# EAGLE design WWVB_BINARY_CLOCK (EAGLE 5.11)
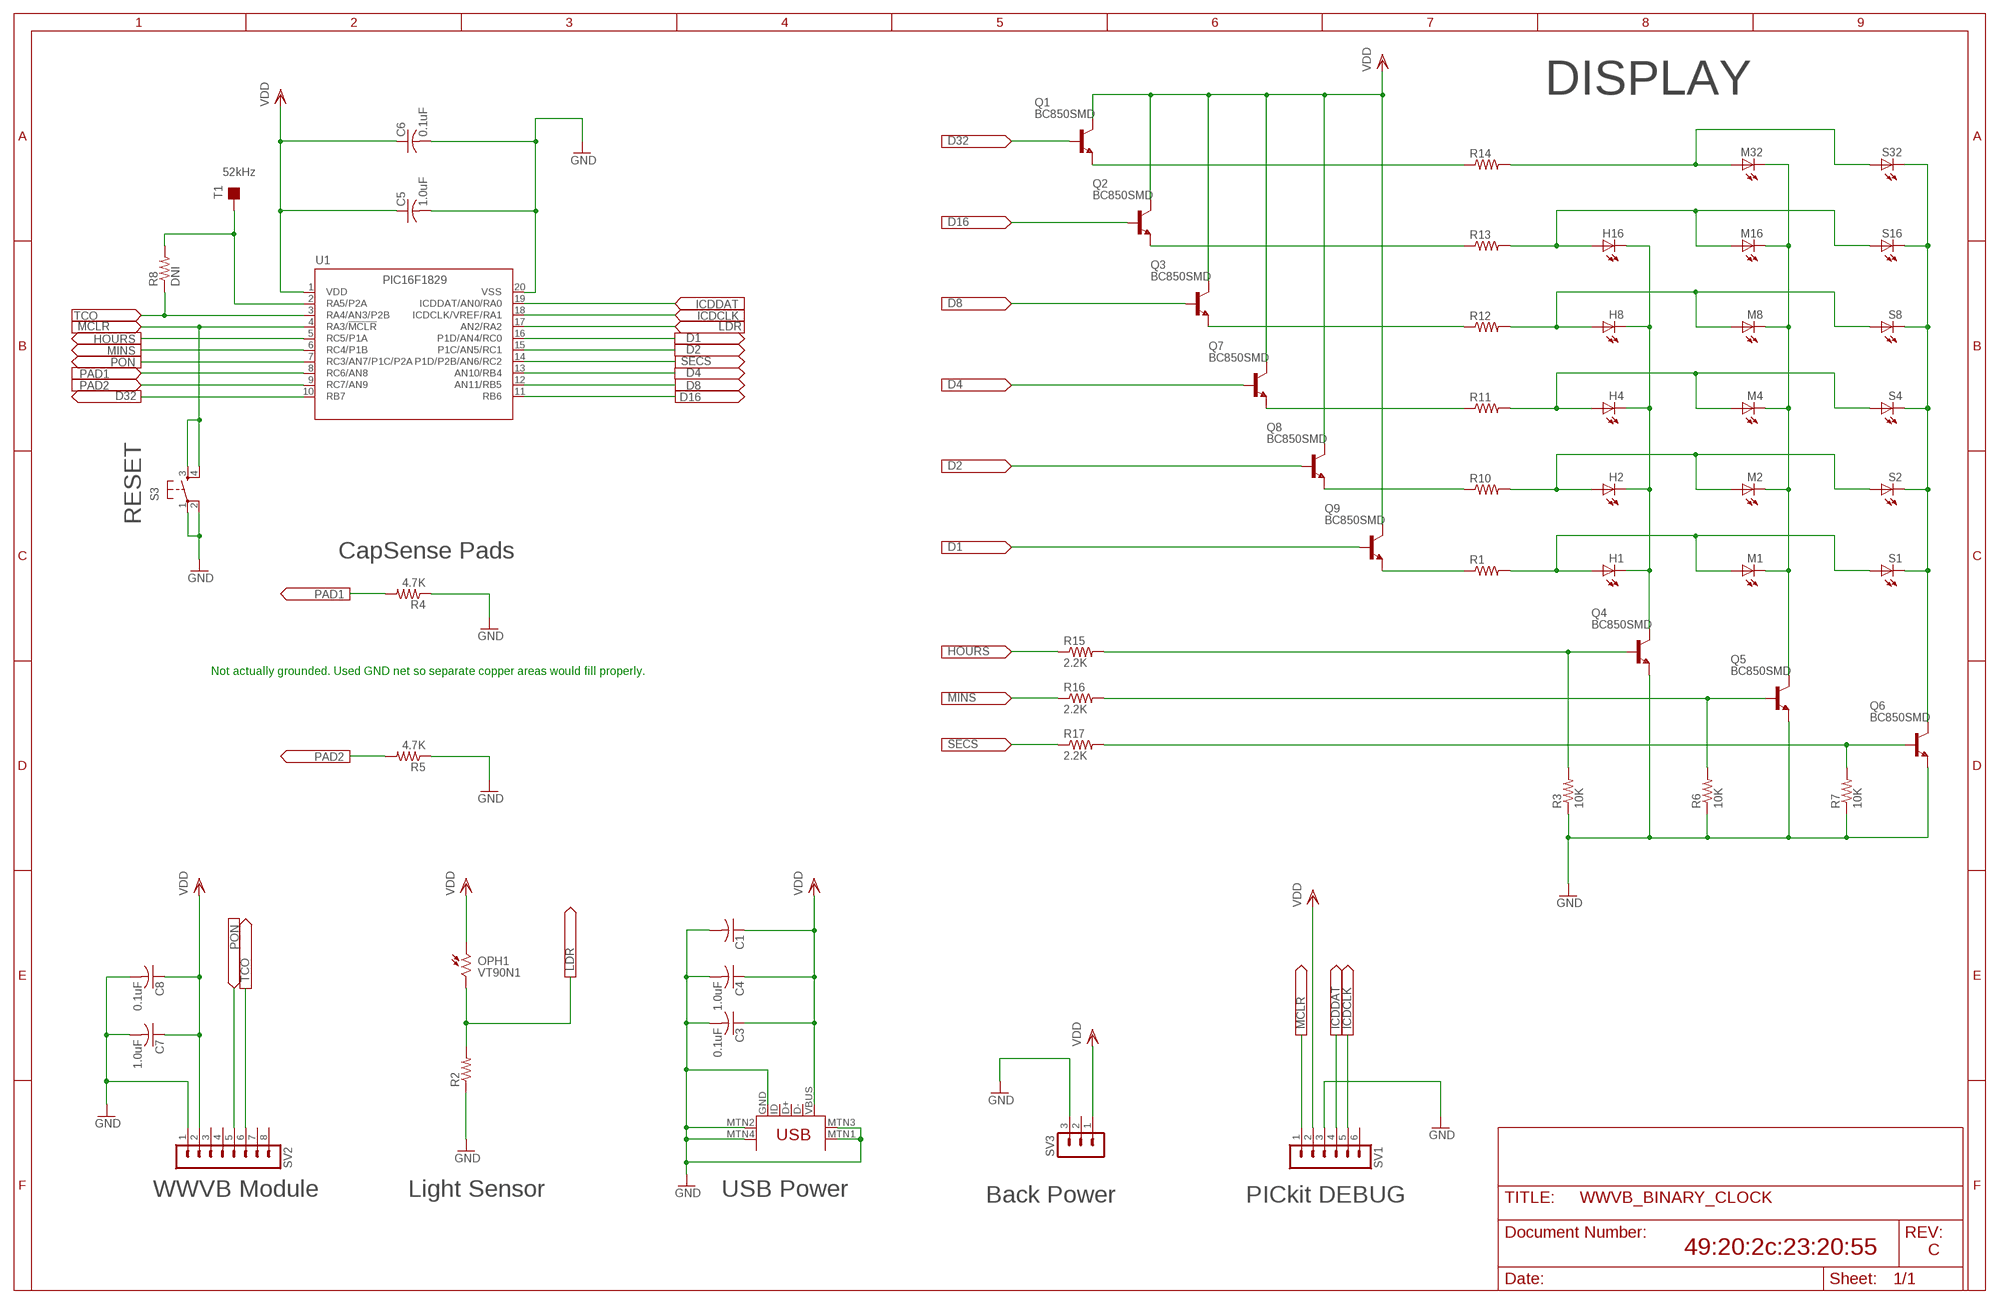
[diagram p0: schematic, sheet 1]

## Parts
C1  C-USC1206  [C1206]
C3  0.1uF  C-USC0805  [C0805]
C4  1.0uF  C-USC0805  [C0805]
C5  1.0uF  C-USC0805  [C0805]
C6  0.1uF  C-USC0805  [C0805]
C7  1.0uF  C-USC0805  [C0805]
C8  0.1uF  C-USC0805  [C0805]
H1  LED5MM  [LED5MM]
H2  LED5MM  [LED5MM]
H4  LED5MM  [LED5MM]
H8  LED5MM  [LED5MM]
H16  LED5MM  [LED5MM]
M1  LED5MM  [LED5MM]
M2  LED5MM  [LED5MM]
M4  LED5MM  [LED5MM]
M8  LED5MM  [LED5MM]
M16  LED5MM  [LED5MM]
M32  LED5MM  [LED5MM]
OPH1  VT90N1  [VT900]
Q1  BC850SMD  [SOT23-BEC]
Q2  BC850SMD  [SOT23-BEC]
Q3  BC850SMD  [SOT23-BEC]
Q4  BC850SMD  [SOT23-BEC]
Q5  BC850SMD  [SOT23-BEC]
Q6  BC850SMD  [SOT23-BEC]
Q7  BC850SMD  [SOT23-BEC]
Q8  BC850SMD  [SOT23-BEC]
Q9  BC850SMD  [SOT23-BEC]
R1  R-US_R0805  [R0805]
R2  R-US_M0805  [M0805]
R3  10K  R-US_M0805  [M0805]
R4  4.7K  R-US_R0805  [R0805]
R5  4.7K  R-US_M0805  [M0805]
R6  10K  R-US_M0805  [M0805]
R7  10K  R-US_R0805  [R0805]
R8  DNI  R-US_R0805  [R0805]
R10  R-US_M0805  [M0805]
R11  R-US_M0805  [M0805]
R12  R-US_M0805  [M0805]
R13  R-US_M0805  [M0805]
R14  R-US_M0805  [M0805]
R15  2.2K  R-US_M0805  [M0805]
R16  2.2K  R-US_M0805  [M0805]
R17  2.2K  R-US_R0805  [R0805]
S1  LED5MM  [LED5MM]
S2  LED5MM  [LED5MM]
S3  TAC_SWITCHPTH  [TACTILE-PTH]
S4  LED5MM  [LED5MM]
S8  LED5MM  [LED5MM]
S16  LED5MM  [LED5MM]
S32  LED5MM  [LED5MM]
SV1  MA06-1  [MA06-1]
SV2  MA08-1  [MA08-1]
SV3  MA03-1  [MA03-1]
T1  TESTPOINTKEYSTONE5015  [KEYSTONE5015]
U1  PIC16F1829  [SOIC20S]
X1  USB-MINIB-5PIN  [USB-MINIB]

## Nets
AN2: OPH1.2 R2.2 U1.17(AN2/RA2)
CPS8: R4.2 U1.8(RC6/AN8)
CPS9: R5.2 U1.9(RC7/AN9)
GND: C1.2 C3.2 C4.2 C5.2 C6.2 C7.2 C8.2 Q4.E Q5.E Q6.E R2.1 R3.1 R4.1 R5.1 R6.1 R7.1 S3.1 S3.2 SV1.3 SV2.1 SV3.3 U1.20(VSS) X1.GND X1.MTN1(MTN2) X1.MTN2(MTN3) X1.MTN3(MTN1) X1.MTN4
ICDCLK: SV1.5 U1.18(ICDCLK/VREF/RA1)
ICDDAT: SV1.4 U1.19(ICDDAT/AN0/RA0)
M1: M1.K(C) M2.K(C) M4.K(C) M8.K(C) M16.K(C) M32.K(C) Q5.C
MCLR: S3.3 S3.4 SV1.1 U1.4(RA3/!MCLR)
N$1: Q9.E R1.1
N$2: Q8.E R10.1
N$3: Q7.E R11.1
N$4: Q3.E R12.1
N$5: Q2.E R13.1
N$6: Q1.E R14.1
N$7: R8.2 T1.1 U1.2(RA5/P2A)
N$10: H1.K(C) H2.K(C) H4.K(C) H8.K(C) H16.K(C) Q4.C
N$11: H1.A M1.A R1.2 S1.A
N$12: H2.A M2.A R10.2 S2.A
N$16: H4.A M4.A R11.2 S4.A
N$17: H8.A M8.A R12.2 S8.A
N$18: H16.A M16.A R13.2 S16.A
N$19: M32.A R14.2 S32.A
N$20: Q4.B R3.2 R15.2
N$21: Q5.B R6.2 R16.2
N$22: Q6.B R7.2 R17.2
P1A: R15.1 U1.5(RC5/P1A)
P1B: R16.1 U1.6(RC4/P1B)
P1D: R17.1 U1.14(P1D/P2B/AN6/RC2)
RB4: Q7.B U1.13(AN10/RB4)
RB5: Q3.B U1.12(AN11/RB5)
RB6: Q2.B U1.11(RB6)
RB7: Q1.B U1.10(RB7)
RC0: Q9.B U1.16(P1D/AN4/RC0)
RC1: Q8.B U1.15(P1C/AN5/RC1)
RC3: SV2.5 U1.7(RC3/AN7/P1C/P2A)
S4: Q6.C S1.K(C) S2.K(C) S4.K(C) S8.K(C) S16.K(C) S32.K(C)
T1G: R8.1 SV2.6 U1.3(RA4/AN3/P2B)
VDD: C1.1 C3.1 C4.1 C5.1 C6.1 C7.1 C8.1 OPH1.1 Q1.C Q2.C Q3.C Q7.C Q8.C Q9.C SV1.2 SV2.2 SV3.1 U1.1(VDD) X1.VBUS
Unconnected: SV1.6 SV2.3 SV2.4 SV2.7 SV2.8 SV3.2 X1.D+ X1.D- X1.ID

## Notes on the sheet
- DISPLAY
- 52kHz
- RESET
- CapSense Pads
- Not actually grounded. Used GND net so separate copper areas would fill properly.
- Back Power | PICkit DEBUG
- WWVB Module | Light Sensor | USB Power
- 49:20:2c:23:20:55 | C

## Library data of the parts
C1 C3-C8 = resistor:C-US: CAPACITOR, American symbol
H1 H2 H4 H8 H16 M1 M2 M4 M8 M16 M32 S1 S2 S4 S8 S16 S32 = led:LED: LED OSRAM: - CHIPLED LG R971, LG N971, LY N971, LG Q971, LY Q971, LO R971, LY R971 LH N974, LH R974 LS Q976, LO Q976, LY Q976 LO Q996 - Hyper CHIPLED LW Q18S LB Q993, LB Q99A, LB R99A - SideLED LS A670, LO A670, LY A670, LG A670, LP A670 LB A673, LV A673, LT A673, LW A673 LH A674 LY A675 LS A676, LA A676, LO A676, LY A676, LW A676 LS A679, LY A679, LG A679 - Hyper Micro SIDELED® LS Y876, LA Y876, LO Y876, LY Y876 LT Y87S - SmartLED LW L88C, LW L88S LB L89C, LB L89S, LG L890 LS L89K, LO L89K, LY L89K LS L896, LA L896, LO L896, LY L896 - TOPLED LS T670, LO T670, LY T670, LG T670, LP T670 LSG T670, LSP T670, LSY T670, LOP T670, LYG T670 LG T671, LOG T671, LSG T671 LB T673, LV T673, LT T673, LW T673 LH T674 LS T676, LA T676, LO T676, LY T676, LB T676, LH T676, LSB T676, LW T676 LB T67C, LV T67C, LT T67C, LS T67K, LO T67K, LY T67K, LW E67C LS E67B, LA E67B, LO E67B, LY E67B, LB E67C, LV E67C, LT E67C LW T67C LS T679, LY T679, LG T679 LS T770, LO T770, LY T770, LG T770, LP T770 LB T773, LV T773, LT T773, LW T773 LH T774 LS E675, LA E675, LY E675, LS T675 LS T776, LA T776, LO T776, LY T776, LB T776 LHGB T686 LT T68C, LB T68C - Hyper Mini TOPLED® LB M676 - Mini TOPLED Santana® LG M470 LS M47K, LO M47K, LY M47K Source: http://www.osram.convergy.de LUXEON: - LUMILED® LXK2-PW12-R00, LXK2-PW12-S00, LXK2-PW14-U00, LXK2-PW14-V00 LXK2-PM12-R00, LXK2-PM12-S00, LXK2-PM14-U00 LXK2-PE12-Q00, LXK2-PE12-R00, LXK2-PE12-S00, LXK2-PE14-T00, LXK2-PE14-U00 LXK2-PB12-K00, LXK2-PB12-L00, LXK2-PB12-M00, LXK2-PB14-N00, LXK2-PB14-P00, LXK2-PB14-Q00 LXK2-PR12-L00, LXK2-PR12-M00, LXK2-PR14-Q00, LXK2-PR14-R00 LXK2-PD12-Q00, LXK2-PD12-R00, LXK2-PD12-S00 LXK2-PH12-R00, LXK2-PH12-S00 LXK2-PL12-P00, LXK2-PL12-Q00, LXK2-PL12-R00 Source: www.luxeon.com KINGBRIGHT: KA-3528ASYC Source: www.kingbright.com
OPH1 = photo-elements:VT9: Photoconductive Cell VT900 Series Source: http://optoelectronics.perkinelmer.com/content/Datasheets/DTS_vt900seriesdatasheet.pdf
Q1-Q9 = transistor-npn:BC850*: NPN Transistor
R1-R8 R10-R17 = resistor:R-US_: RESISTOR, American symbol
S3 = SparkFun:TAC_SWITCH: Momentary Switch Button commonly used for reset or general input. Spark Fun Electronics SKU : COM-00097
SV1 = con-lstb:MA06-1: PIN HEADER; OC_FARNELL: unknown; OC_NEWARK: unknown
SV2 = con-lstb:MA08-1: PIN HEADER; OC_FARNELL: unknown; OC_NEWARK: unknown
SV3 = con-lstb:MA03-1: PIN HEADER; OC_FARNELL: unknown; OC_NEWARK: unknown
T1 = ads4:TESTPOINT: Test point
U1 = atmel:PIC16F1829
X1 = SparkFun:USB-MINIB: Mini-USB "B" connector with 5th pin broken out. Created new symbol breaking out 5th "ID" pin in mini/micro USB connector spec. See: http://en.wikipedia.org/wiki/Mini_usb#Cables. Uses same footprint as 4-pin symbol. Also added pins to connect to mounting / shield pads if required (probably not generally needed as signals aren't shielded once they leave the connector).

## Board
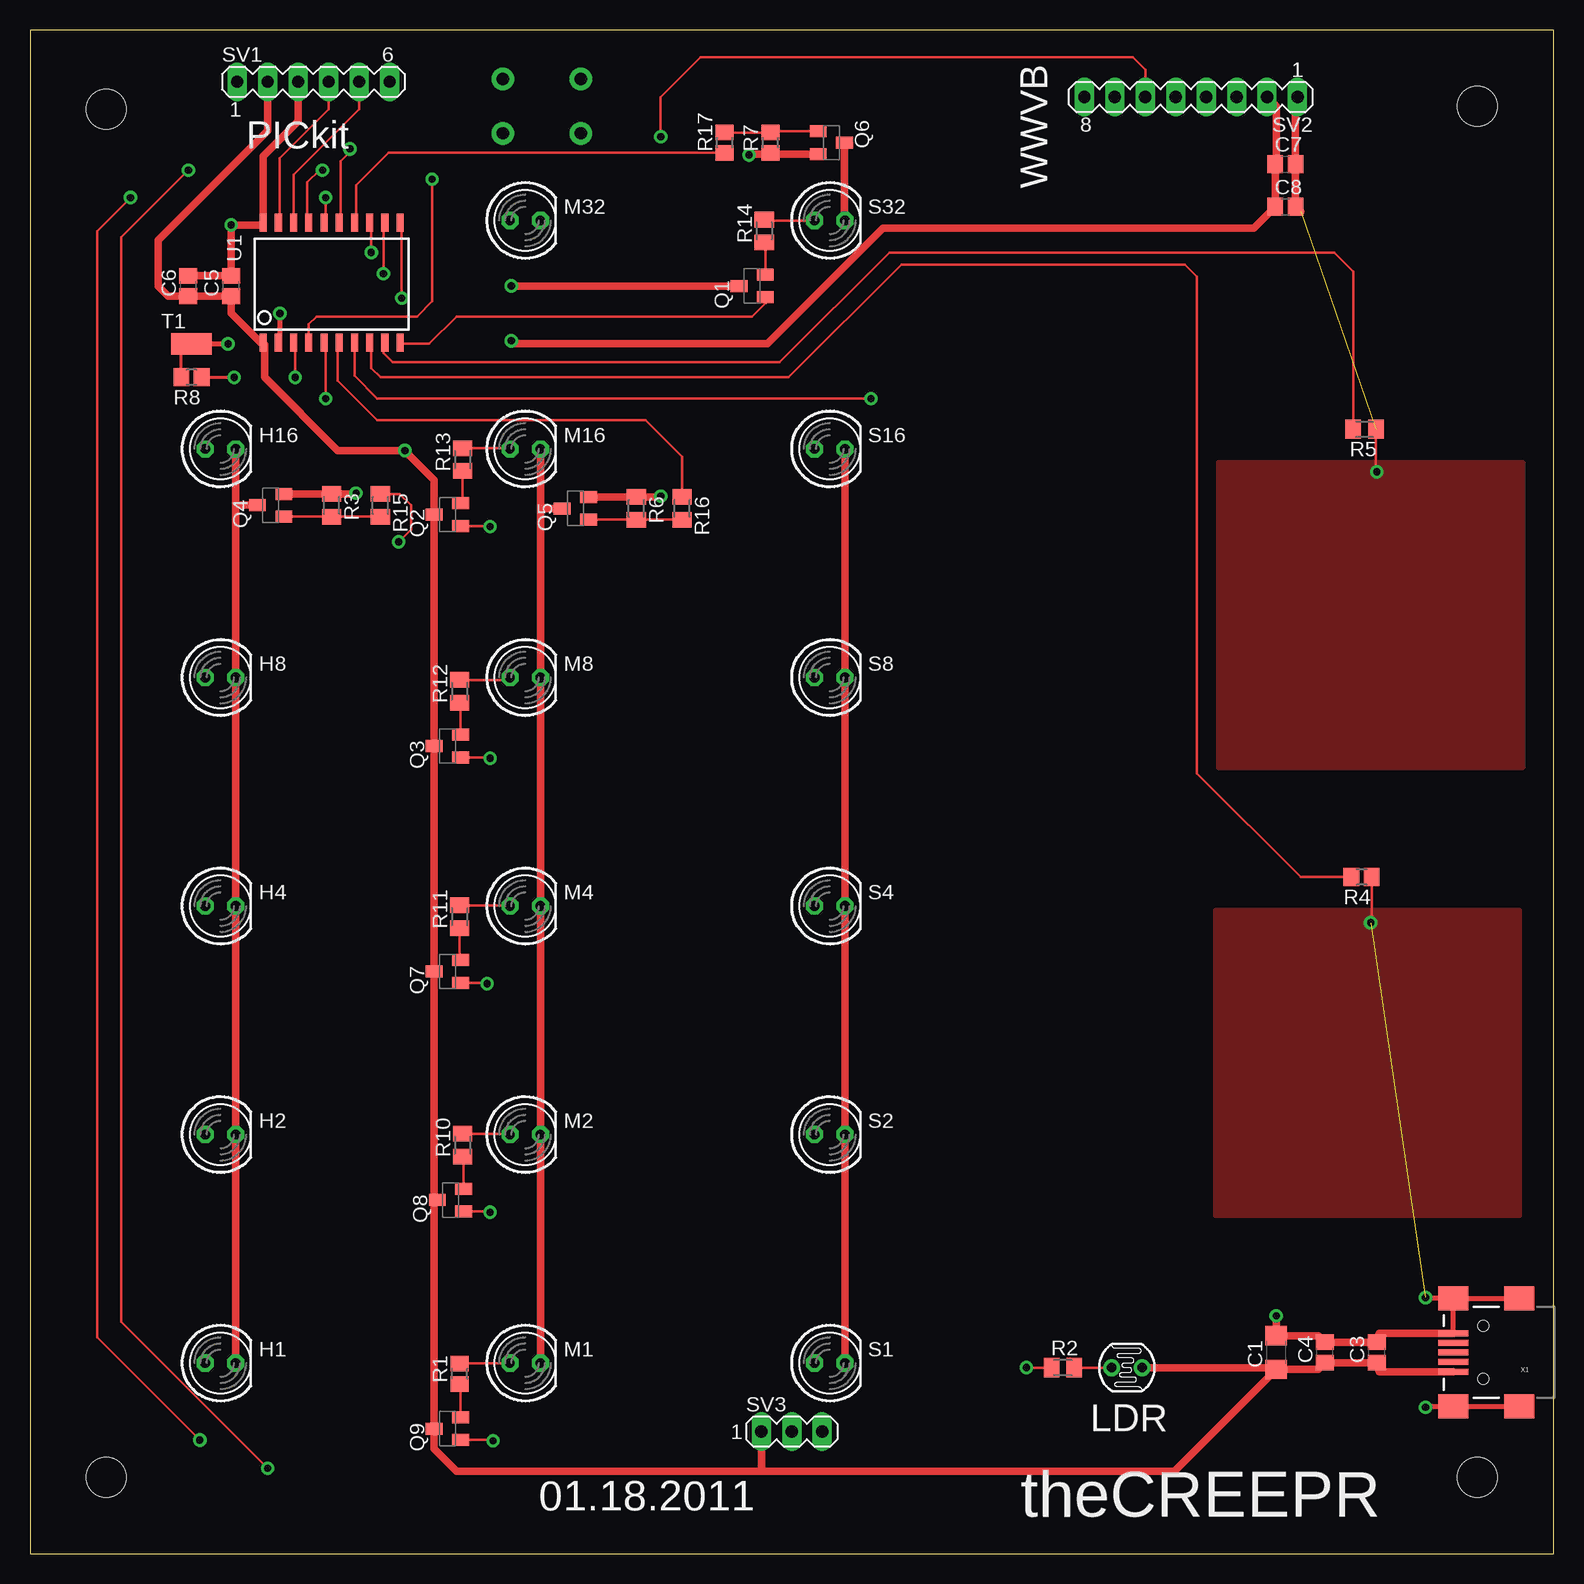
[diagram p1: board, top side]
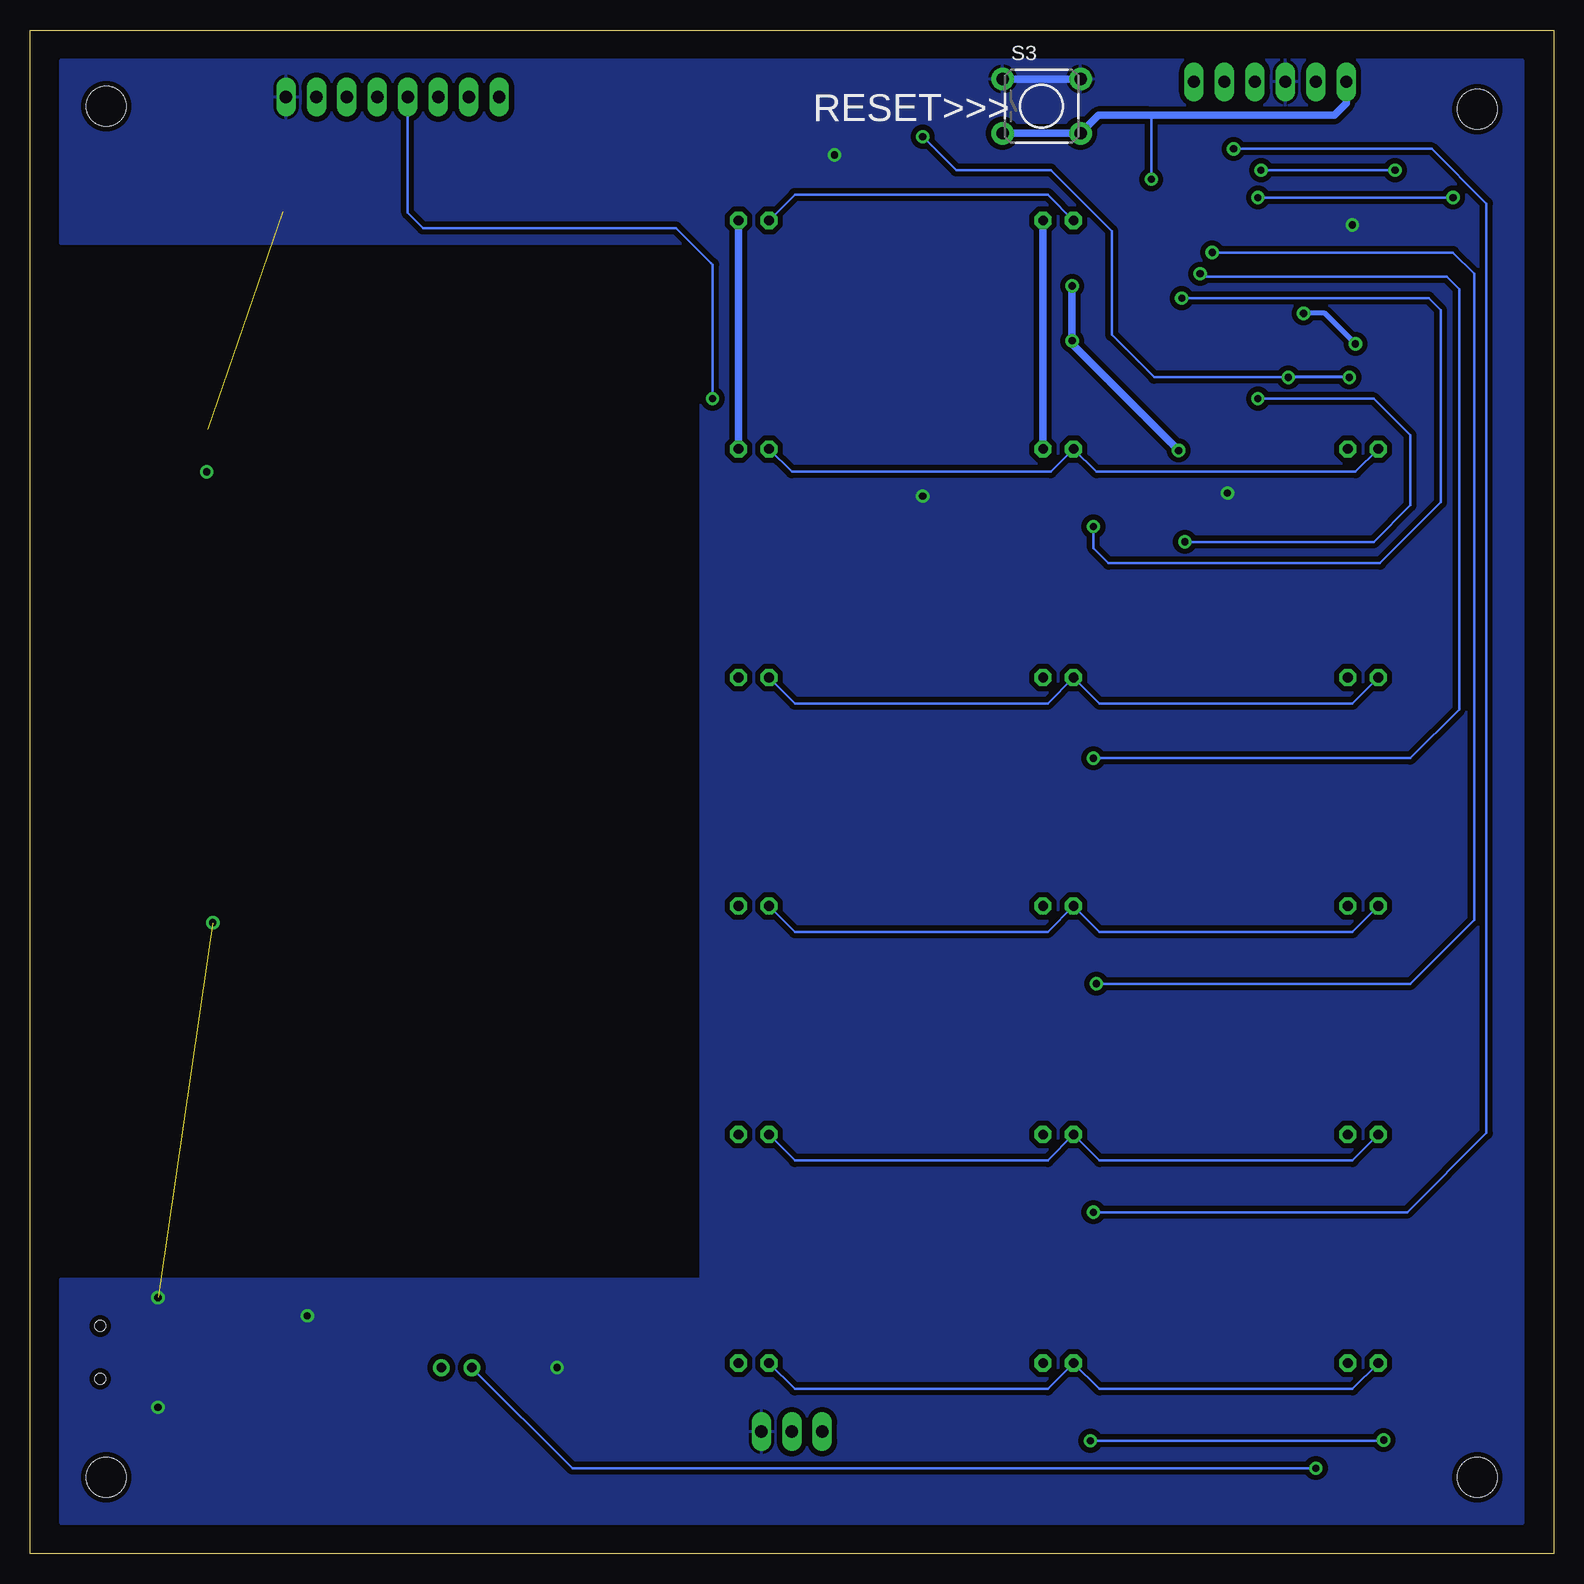
[diagram p2: board, bottom side, seen from below]

Size 127 x 127 mm. Coordinates in mm from the lower left corner, seen from the top.
Outline: 0,0 127,0 127,127 0,127 0,0
Copper layers (1*16): Top 0.035mm / dielectric 1.5mm / Bottom 0.035mm
Design rules "SparkFun": minimum track width 8mil, minimum drill 20mil, track to track 8mil, track to pad 8mil, pad to pad 8mil, via to via 8mil, smd to smd 8mil, copper to edge 10mil, drill to drill 8mil, minimum pad ring 12mil, minimum via ring 10mil, stop-mask expansion 4mil, vias tented up to drill 25mil, thermal gap 10mil
Holes 3.3 mm at 120.65,120.65 120.65,6.35 6.35,6.35 6.35,120.4

### Footprints (pad centres in the part's own frame; a part is rotated, then mirrored left to right if it is on the bottom)
C1206 = smd 1.6 x 1.8: 1 -1.4,0; 2 1.4,0
C0805 = smd 1.3 x 1.5: 1 -0.85,0; 2 0.85,0
LED5MM = drill 0.813 octagon: A -1.27,0; K 1.27,0
VT900 = drill 0.8 pad 1.4 round: 1 -1.27,0; 2 1.27,0
SOT23-BEC = smd 1 x 1.4: B -0.95,-1.1; C 0,1.1; E 0.95,-1.1
R0805 = smd 1.3 x 1.5: 1 -0.85,0; 2 0.85,0
M0805 = smd 1.3 x 1.6: 1 -0.95,0; 2 0.95,0
TACTILE-PTH = drill 1.016 pad 1.88 round: 1 -3.251,2.261; 2 3.251,2.261; 3 -3.251,-2.261; 4 3.251,-2.261
MA06-1 = drill 1.016 long: 1 -6.35,0; 2 -3.81,0; 3 -1.27,0; 4 1.27,0; 5 3.81,0; 6 6.35,0
MA08-1 = drill 1.016 long: 1 -8.89,0; 2 -6.35,0; 3 -3.81,0; 4 -1.27,0; 5 1.27,0; 6 3.81,0; 7 6.35,0; 8 8.89,0
MA03-1 = drill 1.016 long: 1 -2.54,0; 2 0,0; 3 2.54,0
KEYSTONE5015 = smd 3.4 x 1.8: 1 0,0
SOIC20S = smd 0.6 x 1.5: 1 -5.715,-5; 2 -4.445,-5; 3 -3.175,-5; 4 -1.905,-5; 5 -0.635,-5; 6 0.635,-5; 7 1.905,-5; 8 3.175,-5; 9 4.445,-5; 10 5.715,-5; 11 5.715,5; 12 4.445,5; 13 3.175,5; 14 1.905,5; 15 0.635,5; 16 -0.635,5; 17 -1.905,5; 18 -3.175,5; 19 -4.445,5; 20 -5.715,5
USB-MINIB = smd 2.5 x 0.5: D+ 2.5,0; D- 2.5,0.8; GND 2.5,-1.6; ID 2.5,-0.8; VBUS 2.5,1.6 | smd 2.5 x 2: MTN1 -3,4.5; MTN2 2.5,4.5; MTN3 -3,-4.5; MTN4 2.5,-4.5 | hole 0.9: 0,2.2; 0,-2.2

### Placement (x,y rotation side)
C1  103.89,16.76 90 top
C3  112.27,16.76 90 top
C4  107.95,16.76 90 top
C5  16.76,105.66 90 top
C6  13.21,105.66 90 top
C7  104.65,115.82 0 top
C8  104.65,112.27 0 top
H1  15.88,15.88 0 top
H2  15.88,34.92 0 top
H4  15.88,53.98 0 top
H8  15.88,73.03 0 top
H16  15.88,92.08 0 top
M1  41.27,15.88 0 top
M2  41.27,34.92 0 top
M4  41.27,53.98 0 top
M8  41.27,73.03 0 top
M16  41.27,92.08 0 top
M32  41.27,111.12 0 top
OPH1  91.44,15.49 180 top
Q1  60.2,105.66 90 top
Q2  34.8,86.61 90 top
Q3  34.8,67.31 90 top
Q4  20.07,87.38 90 top
Q5  45.47,87.12 90 top
Q6  66.8,117.6 270 top
Q7  34.8,48.51 90 top
Q8  35.05,29.46 90 top
Q9  34.8,10.41 90 top
R1  35.81,14.99 90 top
R2  86.11,15.49 0 top
R3  25.15,87.38 270 top
R4  111,56.39 180 top
R5  111.25,93.73 180 top
R6  50.55,87.12 270 top
R7  61.72,117.6 90 top
R8  13.46,98.04 180 top
R10  36.07,34.04 90 top
R11  35.81,53.09 90 top
R12  35.81,71.88 90 top
R13  36.07,91.19 90 top
R14  61.21,110.24 90 top
R15  29.21,87.38 270 top
R16  54.36,87.12 270 top
R17  57.91,117.6 90 top
S1  66.67,15.88 0 top
S2  66.67,34.92 0 top
S3  42.67,120.65 0 bottom
S4  66.67,53.98 0 top
S8  66.67,73.03 0 top
S16  66.67,92.08 0 top
S32  66.67,111.12 0 top
SV1  23.62,122.68 0 top
SV2  96.77,121.41 180 top
SV3  63.5,10.16 0 top
T1  13.46,100.84 0 top
U1  25.15,105.92 0 top
X1  121.16,16.76 180 top

### Tracks (layer width: path | path; a pad name or v marks a point on that pad's centre or on a via)
AN2  (via drill 0.6)
  Top 0.203: OPH1.2 R2.2 | v19.81,7.11 7.62,19.3 7.62,109.73 v13.21,115.32 | v24.38,115.32 24.13,115.32 23.11,114.3 23.11,111.05 U1.17
  Bottom 0.203: v19.81,7.11 81.79,7.11 OPH1.2 | v13.21,115.32 v24.38,115.32
CPS8
  Top 0.203: R4.2 105.92,56.39 97.28,65.02 97.28,106.43 96.27,107.44 72.64,107.44 63.25,98.04 29.21,98.04 28.45,98.81 28.45,100.79 U1.8
CPS9
  Top 0.203: R5.2 110.3,106.87 108.71,108.46 71.63,108.46 62.48,99.31 30.23,99.31 29.46,100.08 29.46,100.79 U1.9
GND  (via drill 0.6)  (2 unrouted)
  Top 0.203: Q6.E 61.82,116.65 R7.1 | 52.51,88.07 v52.58,88.14 | v59.94,116.59 60.01,116.65 | v83.06,15.49 R2.1 | 27.11,88.33 v27.18,88.39 | R5.1 112.2,90.24 v112.27,90.17 | R4.1 111.85,52.67 v111.76,52.58
  Top 0.406: X1.MTN4 X1.MTN3 | X1.GND X1.MTN4 | X1.MTN1 X1.MTN2 116.33,12.26 v116.33,12.19 | X1.MTN4 116.33,21.26 v116.33,21.34
  Top 0.635: C6.2 C5.2 v16.76,110.74 19.26,110.74 U1.20 19.43,116.46 22.35,119.38 SV1.3 | X1.GND 112.47,18.36 C3.2 C4.2 107.4,18.16 C1.2 v103.89,19.81 | Q4.E R3.1 27.11,88.33 | Q5.E R6.1 52.51,88.07 | 60.01,116.65 Q6.E | 105.92,111.85 C8.2 C7.2 105.5,121.25 SV2.1
  Bottom 0.635: S3.2 S3.1
  pour Bottom (isolate 0.432): 124.46,2.54 2.54,2.54 2.54,124.46 124.46,124.46 124.46,109.22 71.12,109.22 71.12,22.86 124.46,22.86
  pour Top: 124.21,53.59 98.81,53.59 98.81,28.19 124.21,28.19
  pour Top: 124.46,90.93 99.06,90.93 99.06,65.53 124.46,65.53
ICDCLK
  Top 0.203: U1.18 21.97,114.94 27.43,120.4 SV1.5
ICDDAT
  Top 0.203: SV1.4 24.89,120.4 20.83,116.33 20.83,111.05 U1.19
M1
  Top 0.635: M1.K M2.K M4.K M8.K 42.55,87.38 | 42.55,87.38 M16.K | Q5.C 42.8,87.12 42.55,87.38
  Bottom 0.635: M16.K M32.K
MCLR  (via drill 0.6)
  Top 0.203: U1.4 23.24,102.49 23.88,103.12 32.26,103.12 33.53,104.39 v33.53,114.55
  Bottom 0.203: S3.4 39.37,118.34 | v33.53,114.55 33.53,119.63 33.78,119.89
  Bottom 0.635: S3.3 S3.4 37.92,119.89 33.78,119.89 18.29,119.89 17.27,120.9 SV1.1
N$1
  Top 0.203: Q9.E 35.9,14.05 R1.1
N$2
  Top 0.203: Q8.E 36.15,33 R10.1
N$3
  Top 0.203: R11.1 35.81,49.55 Q7.E
N$4
  Top 0.203: Q3.E 35.9,70.85 R12.1
N$5
  Top 0.203: 36.07,87.65 Q2.E 36.07,87.73 R13.1
N$6
  Top 0.203: Q1.E 61.3,109.2 R14.1
N$7  (via drill 0.6)
  Top 0.254: R8.2 12.61,99.99 T1.1
  Top 0.406: U1.2 20.83,100.92 v20.83,103.38 | T1.1 v16.51,100.84
  Bottom 0.406: v20.83,103.38 19.05,103.38 v16.51,100.84
N$10
  Top 0.635: 17.14,87.38 H8.K H4.K H2.K H1.K | 17.14,87.38 H16.K | 17.14,87.38 Q4.C
N$11
  Top 0.203: R1.2 39.97,15.84 M1.A
  Bottom 0.203: H1.A 16.76,13.72 37.85,13.72 M1.A 42.16,13.72 63.25,13.72 S1.A
N$12
  Top 0.203: R10.2 39.94,34.99 M2.A
  Bottom 0.203: H2.A 16.76,32.77 37.85,32.77 M2.A 42.16,32.77 63.25,32.77 S2.A
N$16
  Top 0.203: R11.2 39.94,54.04 M4.A
  Bottom 0.203: H4.A 16.76,51.82 37.85,51.82 M4.A 42.16,51.82 63.25,51.82 S4.A
N$17
  Top 0.203: R12.2 39.81,72.83 M8.A
  Bottom 0.203: H8.A 16.76,70.87 37.85,70.87 M8.A 42.16,70.87 63.25,70.87 S8.A
N$18
  Top 0.203: R13.2 39.94,92.14 M16.A
  Bottom 0.203: H16.A 16.51,90.17 38.1,90.17 M16.A 41.91,90.17 63.5,90.17 S16.A
N$19
  Top 0.203: S32.A 61.27,111.12 R14.2
  Bottom 0.203: M32.A 42.16,113.28 63.25,113.28 S32.A
N$20
  Top 0.203: Q4.B R3.2 R15.2
N$21
  Top 0.203: Q5.B R6.2 R16.2
N$22
  Top 0.203: Q6.B 61.82,118.55 R7.2 R17.2
P1A  (via drill 0.6)
  Top 0.203: R15.1 30.8,88.33 31.75,87.38 31.75,85.34 v30.73,84.33 | v24.64,96.27 24.64,100.79 U1.5
  Bottom 0.203: v30.73,84.33 14.99,84.33 11.94,87.38 11.94,93.22 14.99,96.27 v24.64,96.27
P1B
  Top 0.203: R16.1 54.36,91.44 51.31,94.49 28.96,94.49 25.65,97.79 25.65,100.79 U1.6
P1D
  Top 0.203: R17.1 29.88,116.75 27.18,114.05 27.18,111.05 U1.14
  Top 0.254: U1.14 26.92,111.05
RB4  (via drill 0.6)
  Top 0.203: Q7.B 38.03,47.56 v38.1,47.5 | v28.45,108.46 28.45,110.79 U1.13
  Bottom 0.203: v38.1,47.5 11.94,47.5 6.6,52.83 6.6,106.68 8.38,108.46 v28.45,108.46
RB5  (via drill 0.6)
  Top 0.203: Q3.B 38.29,66.36 v38.35,66.29 | v29.46,106.68 29.46,110.79 U1.12
  Bottom 0.203: v38.35,66.29 11.94,66.29 7.87,70.36 7.87,105.41 8.89,106.43 29.21,106.43 v29.46,106.68
RB6  (via drill 0.6)
  Top 0.203: Q2.B 38.29,85.66 v38.35,85.6 | v30.99,104.65 30.99,110.79 U1.11
  Bottom 0.203: v38.35,85.6 38.35,83.82 37.08,82.55 14.48,82.55 9.4,87.63 9.4,103.63 10.41,104.65 v30.99,104.65
RB7
  Top 0.203: Q1.B 61.3,104.22 60.2,103.12 35.56,103.12 33.27,100.84 30.94,100.84 U1.10
RC0  (via drill 0.6)
  Top 0.203: v14.16,9.46 5.59,18.03 5.59,110.24 v8.38,113.03 | v24.64,113.03 24.64,111.05 U1.16 | Q9.B 38.54,9.46 v38.61,9.4
  Bottom 0.203: v8.38,113.03 v24.64,113.03 | v38.61,9.4 14.22,9.4 v14.16,9.46
RC1  (via drill 0.6)
  Top 0.203: Q8.B 38.29,28.51 v38.35,28.45 | v26.67,117.09 26.67,116.84 25.91,116.08 25.91,111.05 U1.15
  Bottom 0.203: v38.35,28.45 12.19,28.45 5.59,35.05 5.59,112.52 10.16,117.09 v26.67,117.09
RC3  (via drill 0.6)
  Top 0.203: U1.7 27.05,98.17 28.96,96.27 v70.1,96.27
  Bottom 0.203: SV2.5 95.5,111.76 94.23,110.49 73.15,110.49 70.23,107.57 70.1,107.44 v70.1,96.27
S4
  Top 0.203: S32.K 67.9,111.17
  Top 0.635: S1.K S2.K S4.K S8.K S16.K | 67.9,111.17 Q6.C
  Bottom 0.635: S16.K S32.K
T1G  (via drill 0.6)
  Top 0.203: v22.1,98.04 22.1,100.79 U1.3 | SV2.6 92.96,123.7 91.95,124.71 55.88,124.71 52.58,121.41 v52.58,118.11
  Top 0.254: R8.1 v17.02,98.04
  Bottom 0.203: v22.1,98.04 33.27,98.04 36.83,101.6 36.83,110.24 41.91,115.32 49.78,115.32 v52.58,118.11
  Bottom 0.254: v17.02,98.04 v22.1,98.04
VDD  (via drill 0.6)
  Top 0.635: C5.1 C6.1 | X1.VBUS 112.47,15.16 C3.1 C4.1 107.4,15.36 C1.1 | 61.21,6.86 35.56,6.86 33.7,8.72 Q9.C 33.7,29.21 Q8.C 33.7,29.72 Q7.C Q3.C Q2.C 33.7,89.49 v31.24,91.95 25.65,91.95 19.56,98.04 19.56,100.79 U1.1 19.22,100.92 16.76,103.38 C5.1 | 61.21,6.86 95.38,6.86 C1.1 | C5.1 11.52,104.81 10.67,105.66 10.67,109.47 19.81,118.62 SV1.2 | v40.13,105.66 Q1.C | OPH1.1 103.76,15.49 C1.1 | v40.13,101.09 40.39,100.84 61.47,100.84 71.12,110.49 102.02,110.49 C8.1 | C8.1 103.38,111.85 | C8.1 C7.1 103.89,115.91 103.89,120.65 SV2.2 | SV3.1 60.96,7.11 61.21,6.86
  Bottom 0.635: v40.13,105.66 v40.13,101.09 40.13,100.84 v31.24,91.95

### Text on the board
tPlace: PICkit | WWVB | LDR | 01.18.2011 | theCREEPR
bPlace: RESET>>>
tDocu: A | B